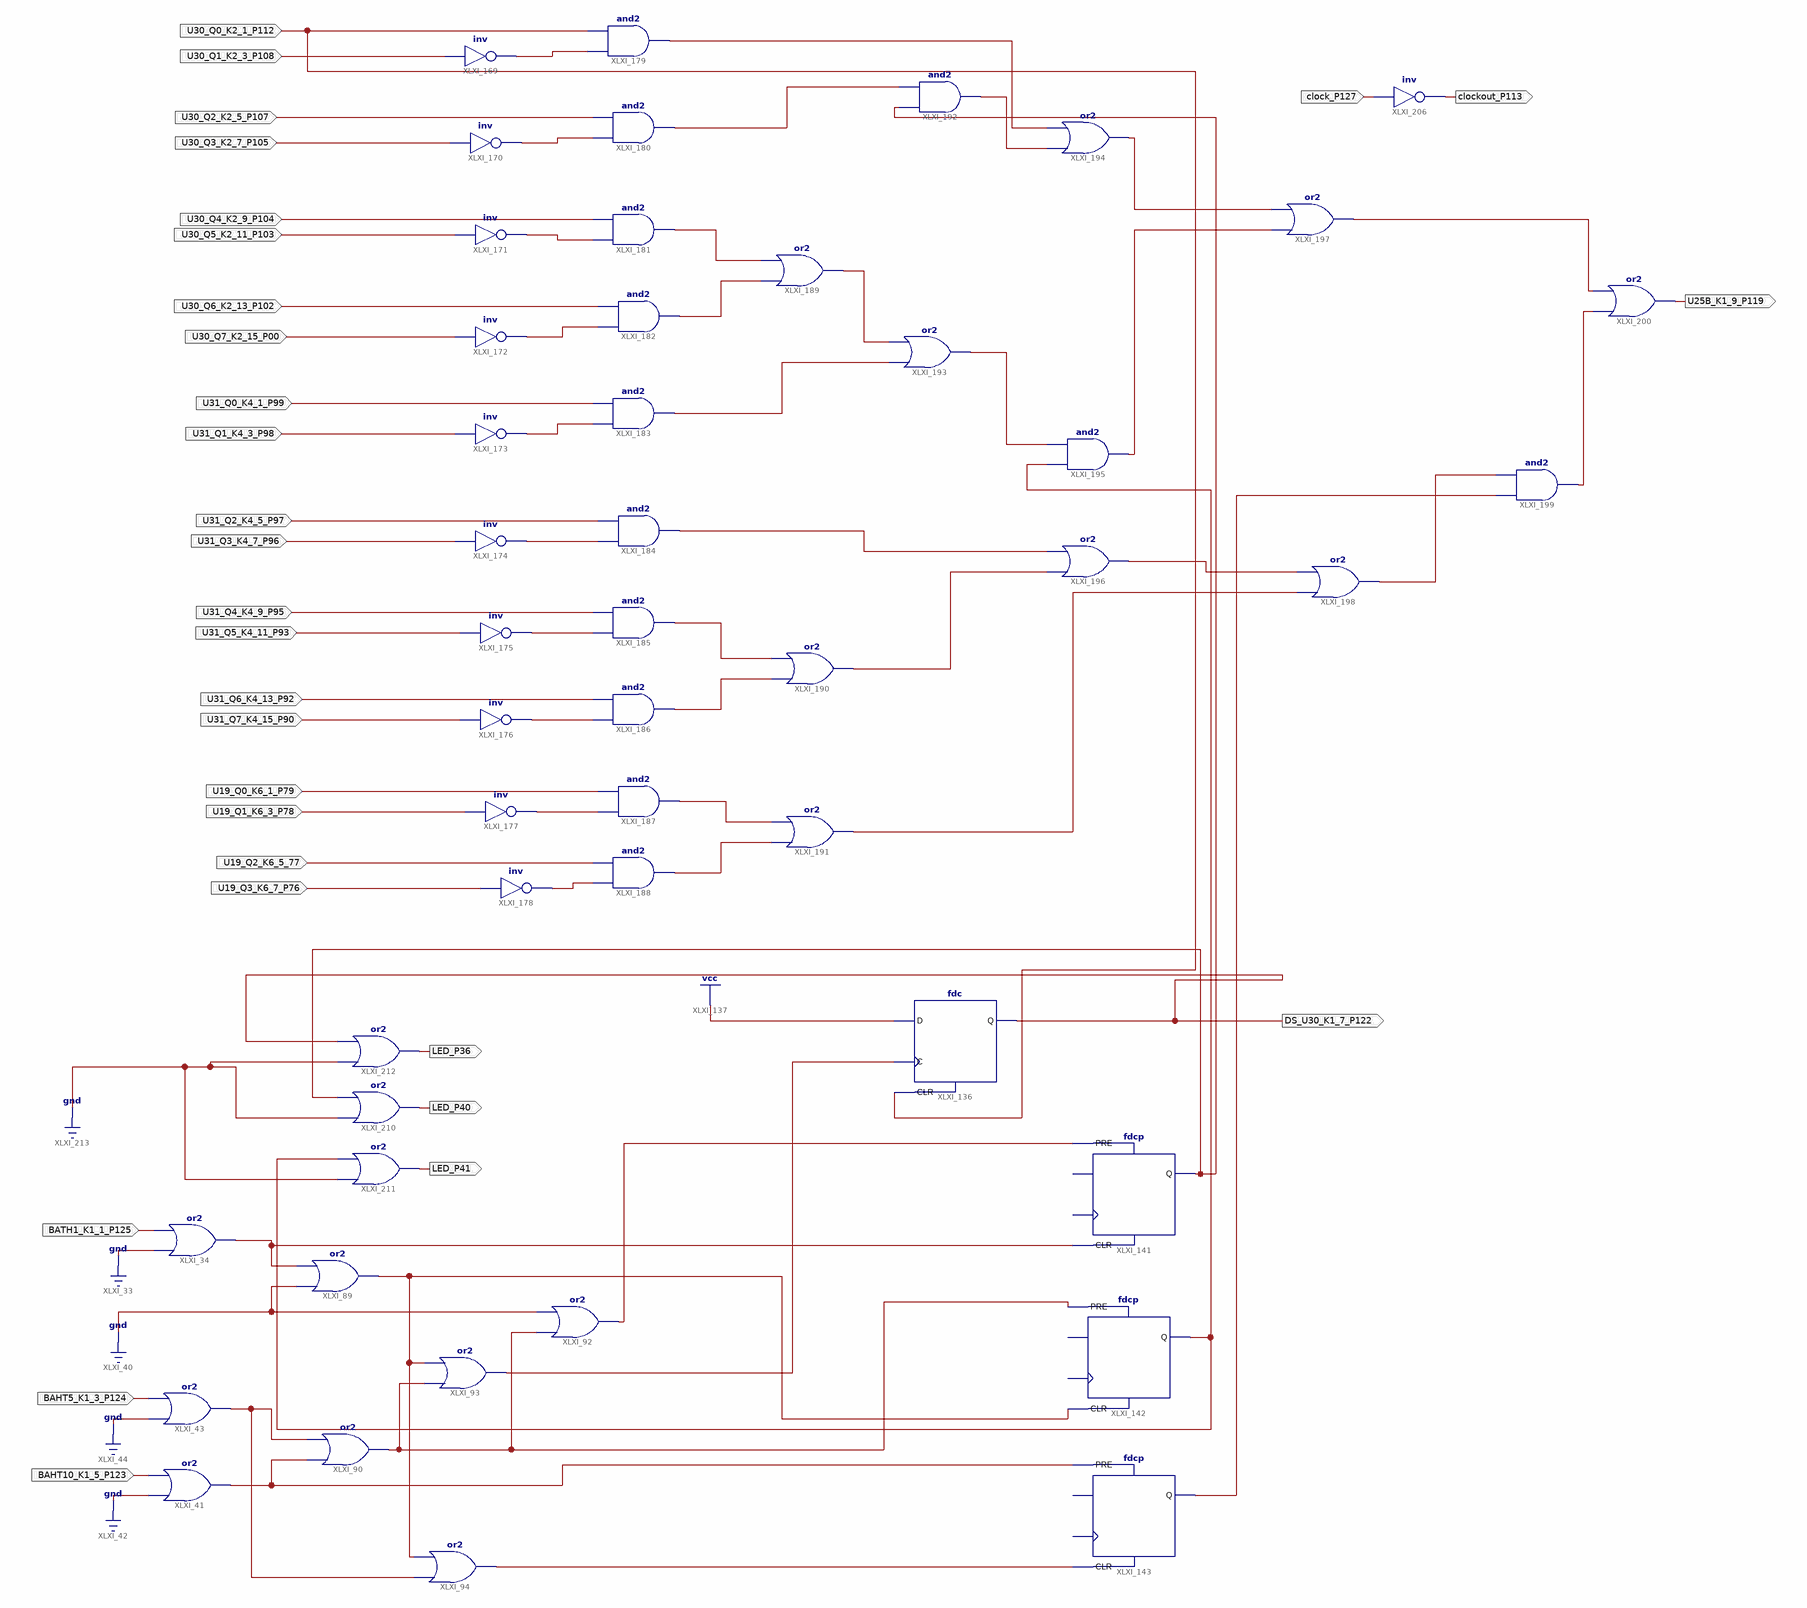
[diagram p0: schematic sheet 1]
// Xilinx ISE schematic main.sch (spartan3) as structural Verilog: 48 symbols, 30 ports
module main (
  input  BATH1_K1_1_P125,
  input  BAHT10_K1_5_P123,
  input  BAHT5_K1_3_P124,
  input  U30_Q0_K2_1_P112,
  input  U30_Q1_K2_3_P108,
  input  U30_Q3_K2_7_P105,
  input  U30_Q2_K2_5_P107,
  input  U30_Q5_K2_11_P103,
  input  U30_Q4_K2_9_P104,
  input  U30_Q6_K2_13_P102,
  input  U31_Q0_K4_1_P99,
  input  U31_Q1_K4_3_P98,
  input  U31_Q2_K4_5_P97,
  input  U31_Q4_K4_9_P95,
  input  U31_Q5_K4_11_P93,
  input  U31_Q6_K4_13_P92,
  input  U31_Q7_K4_15_P90,
  input  U19_Q0_K6_1_P79,
  input  U19_Q1_K6_3_P78,
  input  U19_Q2_K6_5_77,
  input  U19_Q3_K6_7_P76,
  input  U31_Q3_K4_7_P96,
  input  U30_Q7_K2_15_P00,
  input  clock_P127,
  output DS_U30_K1_7_P122,
  output U25B_K1_9_P119,
  output clockout_P113,
  output LED_P36,
  output LED_P40,
  output LED_P41
);

  wire P26, P27, XLXN_143, XLXN_151, XLXN_216, XLXN_217, XLXN_219, XLXN_277, XLXN_278, XLXN_279, XLXN_280,
       XLXN_281, XLXN_282, XLXN_283, XLXN_284, XLXN_285, XLXN_286, XLXN_287, XLXN_288, XLXN_289, XLXN_290,
       XLXN_291, XLXN_292, XLXN_293, XLXN_296, XLXN_297, XLXN_300, XLXN_301, XLXN_302, XLXN_303, XLXN_304,
       XLXN_305, XLXN_306, XLXN_307, XLXN_308, XLXN_310, XLXN_311, XLXN_312, XLXN_313, XLXN_314, XLXN_377,
       XLXN_382;

  or XLXI_34 (P26, 1'b0, BATH1_K1_1_P125);
  or XLXI_41 (XLXN_377, 1'b0, BAHT10_K1_5_P123);
  or XLXI_43 (P27, 1'b0, BAHT5_K1_3_P124);
  or XLXI_90 (XLXN_151, XLXN_377, P27);
  or XLXI_93 (XLXN_219, XLXN_151, XLXN_143);
  or XLXI_92 (XLXN_217, XLXN_151, 1'b0);
  or XLXI_89 (XLXN_143, 1'b0, P26);
  or XLXI_94 (XLXN_216, P27, XLXN_143);
  fdc XLXI_136 (.C(XLXN_219), .CLR(U30_Q0_K2_1_P112), .D(1'b1), .Q(DS_U30_K1_7_P122));
  fdcp XLXI_141 (.CLR(P26), .PRE(XLXN_217), .Q(XLXN_382));  // open: C, D
  fdcp XLXI_142 (.CLR(XLXN_143), .PRE(XLXN_151), .Q(XLXN_307));  // open: C, D
  fdcp XLXI_143 (.CLR(XLXN_216), .PRE(XLXN_377), .Q(XLXN_311));  // open: C, D
  not XLXI_169 (XLXN_277, U30_Q1_K2_3_P108);
  not XLXI_170 (XLXN_278, U30_Q3_K2_7_P105);
  not XLXI_171 (XLXN_279, U30_Q5_K2_11_P103);
  not XLXI_172 (XLXN_280, U30_Q7_K2_15_P00);
  not XLXI_173 (XLXN_281, U31_Q1_K4_3_P98);
  not XLXI_174 (XLXN_282, U31_Q3_K4_7_P96);
  not XLXI_175 (XLXN_283, U31_Q5_K4_11_P93);
  not XLXI_176 (XLXN_284, U31_Q7_K4_15_P90);
  not XLXI_177 (XLXN_285, U19_Q1_K6_3_P78);
  not XLXI_178 (XLXN_286, U19_Q3_K6_7_P76);
  and XLXI_179 (XLXN_296, XLXN_277, U30_Q0_K2_1_P112);
  and XLXI_180 (XLXN_293, XLXN_278, U30_Q2_K2_5_P107);
  and XLXI_181 (XLXN_287, XLXN_279, U30_Q4_K2_9_P104);
  and XLXI_182 (XLXN_288, XLXN_280, U30_Q6_K2_13_P102);
  and XLXI_183 (XLXN_301, XLXN_281, U31_Q0_K4_1_P99);
  and XLXI_184 (XLXN_303, XLXN_282, U31_Q2_K4_5_P97);
  and XLXI_185 (XLXN_289, XLXN_283, U31_Q4_K4_9_P95);
  and XLXI_186 (XLXN_290, XLXN_284, U31_Q6_K4_13_P92);
  and XLXI_187 (XLXN_291, XLXN_285, U19_Q0_K6_1_P79);
  and XLXI_188 (XLXN_292, XLXN_286, U19_Q2_K6_5_77);
  or XLXI_189 (XLXN_300, XLXN_288, XLXN_287);
  or XLXI_190 (XLXN_304, XLXN_290, XLXN_289);
  or XLXI_191 (XLXN_310, XLXN_292, XLXN_291);
  and XLXI_192 (XLXN_297, XLXN_382, XLXN_293);
  or XLXI_193 (XLXN_302, XLXN_301, XLXN_300);
  or XLXI_194 (XLXN_305, XLXN_297, XLXN_296);
  and XLXI_195 (XLXN_306, XLXN_307, XLXN_302);
  or XLXI_196 (XLXN_308, XLXN_304, XLXN_303);
  or XLXI_197 (XLXN_313, XLXN_306, XLXN_305);
  or XLXI_198 (XLXN_312, XLXN_310, XLXN_308);
  and XLXI_199 (XLXN_314, XLXN_311, XLXN_312);
  or XLXI_200 (U25B_K1_9_P119, XLXN_314, XLXN_313);
  not XLXI_206 (clockout_P113, clock_P127);
  or XLXI_210 (LED_P40, 1'b0, XLXN_382);
  or XLXI_211 (LED_P41, 1'b0, XLXN_307);
  or XLXI_212 (LED_P36, 1'b0, DS_U30_K1_7_P122);
endmodule
